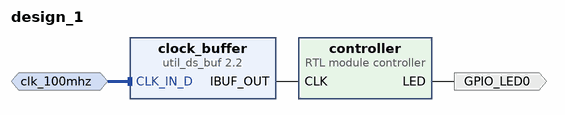
[diagram p0: block diagram of the top level]
# Vivado block design design_1, xczu19eg-ffvc1760-2-i, Vivado 2021.1
create_bd_design design_1

create_bd_intf_port -mode Slave -vlnv xilinx.com:interface:diff_clock_rtl:1.0 clk_100mhz
create_bd_port -dir O GPIO_LED0

create_bd_cell -type ip -vlnv xilinx.com:ip:util_ds_buf:2.2 clock_buffer
create_bd_cell -type module -reference controller controller

# ---- connections ----

connect_bd_intf_net -intf_net CLK_IN_D_0_1 [get_bd_intf_ports clk_100mhz] [get_bd_intf_pins clock_buffer/CLK_IN_D]
connect_bd_net [get_bd_pins clock_buffer/IBUF_OUT] [get_bd_pins controller/CLK]
connect_bd_net -net controller_0_LED [get_bd_pins controller/LED] [get_bd_ports GPIO_LED0]

validate_bd_design
save_bd_design
